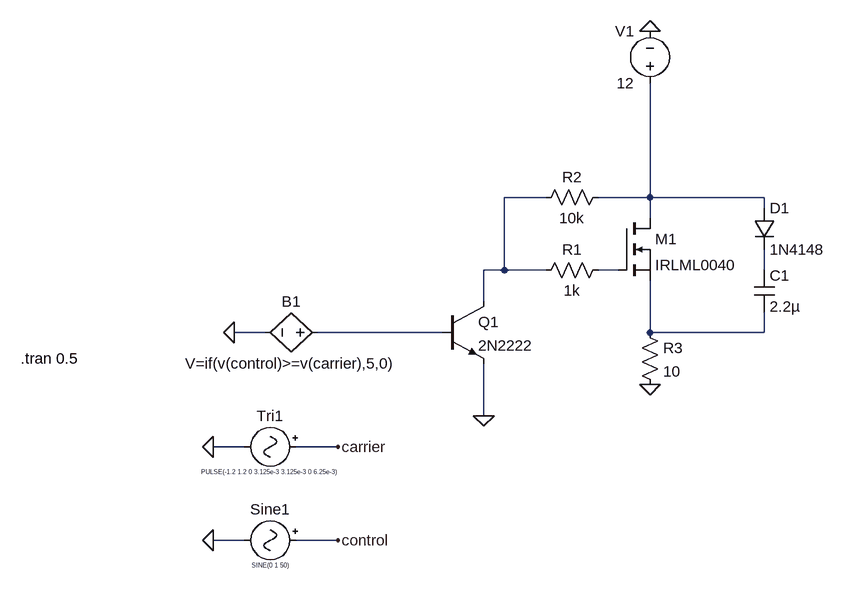
[diagram p0: schematic ElectronoobsMosfetDriver.asc]
ElectronoobsMosfetDriver.asc, the LTspice schematic file:
Version 4
SHEET 1 1092 688
WIRE 480 112 416 112
WIRE 640 112 640 -64
WIRE 640 112 560 112
WIRE 816 112 640 112
WIRE 816 128 816 112
WIRE 640 144 640 112
WIRE 416 224 416 112
WIRE 416 224 384 224
WIRE 480 224 416 224
WIRE 592 224 560 224
WIRE 816 224 816 192
WIRE 384 272 384 224
WIRE 48 320 0 320
WIRE 320 320 128 320
WIRE 640 320 640 240
WIRE 816 320 816 288
WIRE 816 320 640 320
WIRE 384 448 384 368
WIRE 16 496 -32 496
WIRE 160 496 96 496
WIRE 16 640 -32 640
WIRE 160 640 96 640
FLAG -32 496 0
FLAG -32 640 0
FLAG 160 496 carrier
FLAG 160 640 control
FLAG 0 320 0
FLAG 384 448 0
FLAG 640 -144 0
FLAG 640 400 0
SYMBOL signal 112 496 R90
WINDOW 0 -32 56 VBottom 2
WINDOW 3 32 56 VTop 0
SYMATTR InstName Tri1
SYMATTR Value PULSE(-1.2 1.2 0 3.125e-3 3.125e-3 0 6.25e-3)
SYMBOL signal 112 640 R90
WINDOW 0 -32 56 VBottom 2
WINDOW 3 32 56 VTop 0
SYMATTR InstName Sine1
SYMATTR Value SINE(0 1 50)
SYMBOL bv 144 320 R90
WINDOW 3 32 56 VTop 2
WINDOW 0 -32 56 VBottom 2
SYMATTR Value V=if(v(control)>=v(carrier),5,0)
SYMATTR InstName B1
SYMBOL npn 320 272 R0
SYMATTR InstName Q1
SYMATTR Value 2N2222
SYMBOL Res 576 208 R90
WINDOW 0 0 56 VBottom 2
WINDOW 3 32 56 VTop 2
SYMATTR InstName R1
SYMATTR Value 1k
SYMBOL nmos 592 144 R0
SYMATTR InstName M1
SYMATTR Value IRLML0040
SYMBOL Res 576 96 R90
WINDOW 0 0 56 VBottom 2
WINDOW 3 32 56 VTop 2
SYMATTR InstName R2
SYMATTR Value 10k
SYMBOL voltage 640 -48 R180
WINDOW 0 24 96 Left 2
WINDOW 3 24 16 Left 2
SYMATTR InstName V1
SYMATTR Value 12
SYMATTR SpiceLine Rser=0.0
SYMBOL Res 624 304 R0
SYMATTR InstName R3
SYMATTR Value 10
SYMBOL diode 800 128 R0
SYMATTR InstName D1
SYMATTR Value 1N4148
SYMBOL Cap 800 224 R0
SYMATTR InstName C1
SYMATTR Value 2.2µ
TEXT -328 360 Left 2 !.tran 0.5

The netlist it stands for:
* ElectronoobsMosfetDriver.asc
V§Tri1 carrier 0 PULSE(-1.2 1.2 0 3.125e-3 3.125e-3 0 6.25e-3)
V§Sine1 control 0 SINE(0 1 50)
B1 N005 0 V=if(v(control)>=v(carrier),5,0)
Q1 N001 N005 0 0 2N2222
R1 N003 N001 1k
M1 N002 N003 N006 N006 IRLML0040
R2 N002 N001 10k
V1 N002 0 12 Rser=0.0
R3 N006 0 10
D1 N002 N004 1N4148
C1 N004 N006 2.2µ
.model D D
.lib standard.dio
.model NPN NPN
.model PNP PNP
.lib standard.bjt
.model NMOS NMOS
.model PMOS PMOS
.lib standard.mos
.tran 0.5
.backanno
.end